# EAGLE design lcd (EAGLE 4.16)
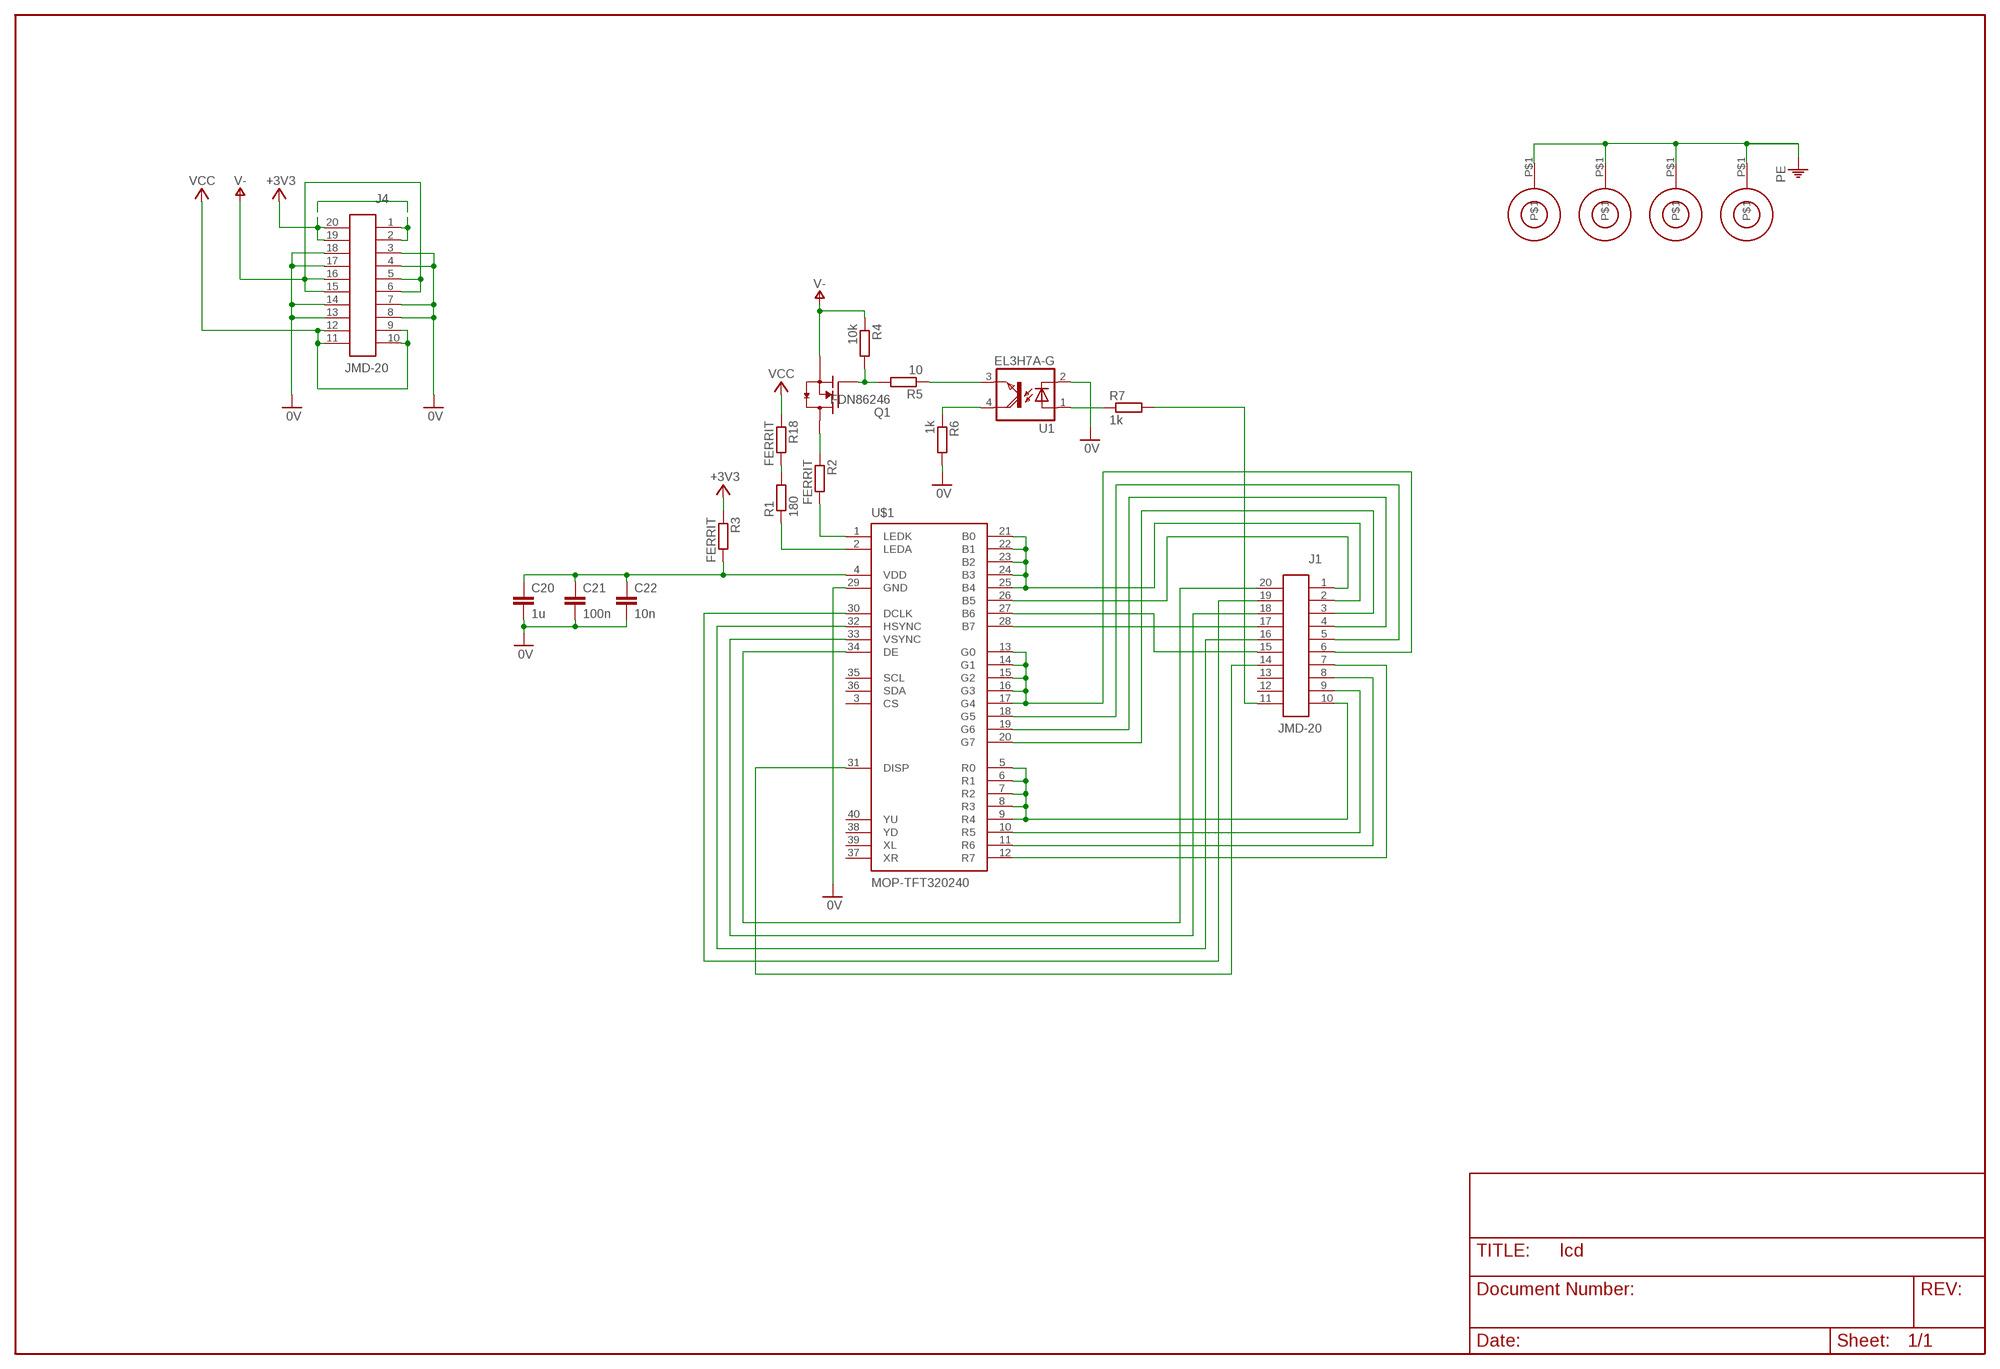
[diagram p0: schematic, sheet 1]

## Parts
C20  1u  C-EUC0603  [C0603]
C21  100n  C-EUC0603  [C0603]
C22  10n  C-EUC0603  [C0603]
J1  JMD-20  [CON]
J4  JMD-20  [CON]
Q1  FDN86246  [SSOT-3]
R1  180  R-EU_R0603  [R0603]
R2  FERRIT  R-EU_R0603  [R0603]
R3  FERRIT  R-EU_R0603  [R0603]
R4  10k  R-EU_R0603  [R0603]
R5  10  R-EU_R0603  [R0603]
R6  1k  R-EU_R0603  [R0603]
R7  1k  R-EU_R0603  [R0603]
R18  FERRIT  R-EU_R0603  [R0603]
U1  EL3H7A-G  [OPTO]
U$1  MOP-TFT320240  [FPC40]
U$3  MOUNT  [MOUNT]
U$4  MOUNT  [MOUNT]
U$7  MOUNT  [MOUNT]
U$11  MOUNT  [MOUNT]

## Nets
0V: C20.2 C21.2 C22.2 J4.3 J4.4 J4.7 J4.8 J4.13 J4.14 J4.17 J4.18 R6.2 U1.2 U$1.29(GND)
+3V3: J4.1 J4.2 J4.19 J4.20 R3.1
N$1: J1.17 U$1.28(B7)
N$4: C20.1 C21.1 C22.1 R3.2 U$1.4(VDD)
N$6: J1.1 U$1.26(B5)
N$7: J1.3 U$1.20(G7)
N$8: J1.4 U$1.19(G6)
N$9: J1.5 U$1.18(G5)
N$10: J1.6 U$1.13(G0) U$1.14(G1) U$1.15(G2) U$1.16(G3) U$1.17(G4)
N$11: J1.7 U$1.12(R7)
N$12: J1.8 U$1.11(R6)
N$13: J1.9 U$1.10(R5)
N$14: J1.10 U$1.5(R0) U$1.6(R1) U$1.7(R2) U$1.8(R3) U$1.9(R4)
N$15: J1.19 U$1.30(DCLK)
N$16: J1.16 U$1.32(HSYNC)
N$17: J1.18 U$1.33(VSYNC)
N$18: J1.20 U$1.34(DE)
N$19: J1.2 U$1.21(B0) U$1.22(B1) U$1.23(B2) U$1.24(B3) U$1.25(B4)
N$21: J1.15 U$1.27(B6)
N$22: R1.1 U$1.2(LEDA)
N$23: R2.2 U$1.1(LEDK)
N$25: R1.2 R18.2
N$26: Q1.D R2.1
N$27: J1.14 U$1.31(DISP)
N$28: R5.1 U1.3
N$29: Q1.G R4.2 R5.2
N$30: R6.1 U1.4
N$31: R7.1 U1.1
N$32: J1.11 R7.2
PE: U$3.P$1 U$4.P$1 U$7.P$1 U$11.P$1
V-: J4.5 J4.6 J4.15 J4.16 Q1.S R4.1
VCC: J4.9 J4.10 J4.11 J4.12 R18.1
Unconnected: J1.12 J1.13 U$1.3(CS) U$1.35(SCL) U$1.36(SDA) U$1.37(XR) U$1.38(YD) U$1.39(XL) U$1.40(YU)

## Library data of the parts
C20-C22 = rcl:C-EU: CAPACITOR, European symbol
J1 J4 = trafo_mod:JMD-20
Q1 = trafo_mod:FDN86246
R1-R7 R18 = rcl:R-EU_: RESISTOR, European symbol
U1 = trafo_mod:EL3H7A-G
U$1 = trafo_mod:MOP-TFT320240
U$3 U$4 U$7 U$11 = trafo_mod:MOUNT

## Board
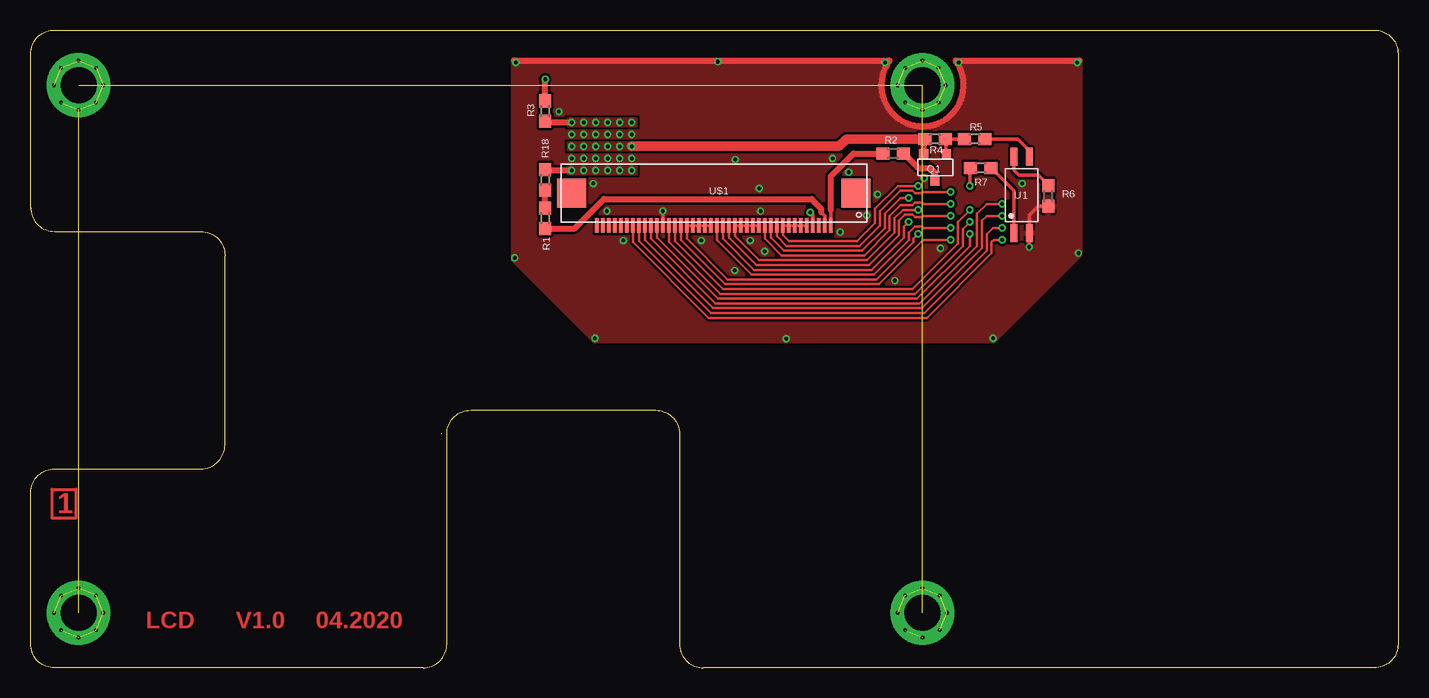
[diagram p1: board, top side]
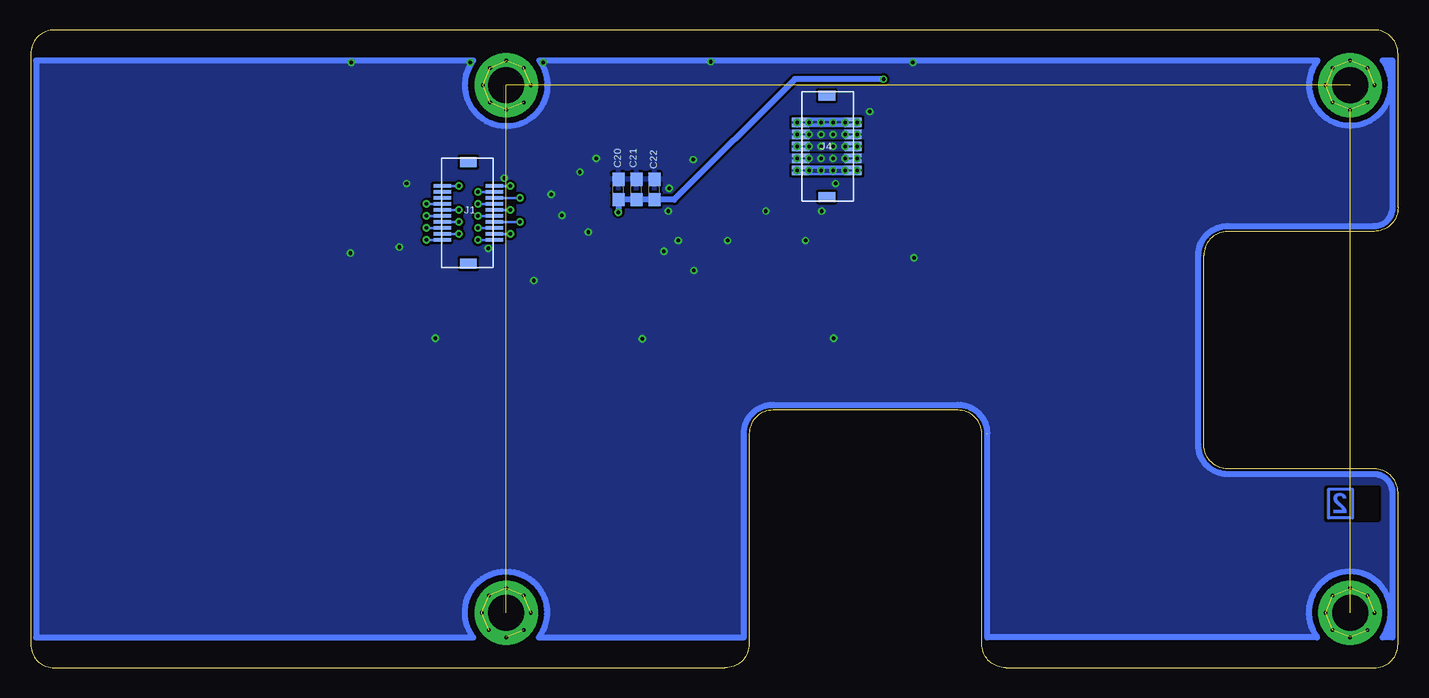
[diagram p2: board, bottom side, seen from below]

Size 114 x 53.2 mm. Coordinates in mm from the lower left corner, seen from the top.
Outline: 43,53.2 112,53.2 arc-90 114,51.2 114,2 arc-90 112,0 56.1,0 arc-90 54.1,2 54.1,19.5 arc90 52.1,21.5 36.7,21.5 arc90 34.7,19.5 34.7,2 arc-90 32.7,0 2,0 arc-90 0,2 0,14.6 arc-90 2,16.6 14.2,16.6 arc90 16.2,18.6 16.2,34.4 arc90 14.2,36.4 2,36.4 arc-90 0,38.4 0,51.2 arc-90 2,53.2 43,53.2
Copper layers (1+2*15+16): Top 0.035mm / dielectric 0.1mm / Route2 0.035mm / dielectric 1.3mm / Route15 0.035mm / dielectric 0.1mm / Bottom 0.035mm
Design rules "default": minimum track width 10mil, minimum drill 0.2mm, track to track 5mil, track to pad 5mil, pad to pad 5mil, via to via 5mil, smd to smd 0mil, copper to edge 12mil, drill to drill 8mil, minimum pad ring 10mil, minimum via ring 4mil, stop-mask expansion 3mil, vias tented up to drill 20mil, thermal gap 0.2mm
tKeepout: area 2.2,9.1 to 5,13.5
bKeepout: area 1.6,12.3 to 6,15
tRestrict: area 2.2,9.1 to 5,13.5; area 71.7,2.1 to 73.1,4.7; area 5.5,2 to 6.7,4.8; area 71.7,48.6 to 73.1,51.4; area 5.7,48.6 to 6.7,51.2; area 1.4,48.6 to 2.3,51.2; area 76,48.6 to 77,51.4; area 75.8,2.1 to 77,4.6; area 1.3,1.4 to 2.6,4.6
bRestrict: area 71.7,2.1 to 73.1,4.7; area 76.1,2.1 to 77,4.6; area 1.6,12.3 to 6,15

### Footprints (pad centres in the part's own frame; a part is rotated, then mirrored left to right if it is on the bottom)
C0603 = smd 1.1 x 1: 1 -0.85,0; 2 0.85,0
CON = smd 0.3 x 1.45: 1 -3,0.5; 2 -2.5,0.5; 3 -2,0.5; 4 -1.5,0.5; 5 -1,0.5; 6 -0.5,0.5; 7 0,0.5; 8 0.5,0.5; 9 1,0.5; 10 1.5,0.5; 11 1.5,4.85; 12 1,4.85; 13 0.5,4.85; 14 0,4.85; 15 -0.5,4.85; 16 -1,4.85; 17 -1.5,4.85; 18 -2,4.85; 19 -2.5,4.85; 20 -3,4.85 | smd 0.85 x 1.4: P$1 -4.975,2.675; P$2 3.475,2.675
SSOT-3 = smd 0.762 x 0.762: D 0,2.286; G -0.953,0; S 0.953,0
R0603 = smd 1.1 x 1: 1 -0.85,0; 2 0.85,0
OPTO = smd 1.5 x 0.6: 1 -2.94,0.47; 2 -2.94,-0.8; 3 3.41,-0.8; 4 3.41,0.47
FPC40 = smd 0.3 x 1.2: 1 -9.3,2.9; 2 -8.8,2.9; 3 -8.3,2.9; 4 -7.8,2.9; 5 -7.3,2.9; 6 -6.8,2.9; 7 -6.3,2.9; 8 -5.8,2.9; 9 -5.3,2.9; 10 -4.8,2.9; 11 -4.3,2.9; 12 -3.8,2.9; 13 -3.3,2.9; 14 -2.8,2.9; 15 -2.3,2.9; 16 -1.8,2.9; 17 -1.3,2.9; 18 -0.8,2.9; 19 -0.3,2.9; 20 0.2,2.9; 21 0.7,2.9; 22 1.2,2.9; 23 1.7,2.9; 24 2.2,2.9; 25 2.7,2.9; 26 3.2,2.9; 27 3.7,2.9; 28 4.2,2.9; 29 4.7,2.9; 30 5.2,2.9; 31 5.7,2.9; 32 6.2,2.9; 33 6.7,2.9; 34 7.2,2.9; 35 7.7,2.9; 36 8.2,2.9; 37 8.7,2.9; 38 9.2,2.9; 39 9.7,2.9; 40 10.2,2.9; P$35 7.7,2.9 | smd 2.4 x 2.4: G1 -11.4,0.2; G2 12.3,0.2
MOUNT = drill 3 pad 5.3 round: P$1 0,0

### Placement (x,y rotation side)
C20  65,39.9 90 bottom
C21  63.5,39.9 90 bottom
C22  62,39.9 90 bottom
J1  74.83,38.7 90 bottom
J4  50.3,42.75 270 bottom
Q1  75.4,42.9 180 top
R1  42.9,37.5 90 top
R2  71.9,42.9 180 top
R3  42.9,46.44 90 top
R4  75.4,44.1 0 top
R5  78.7,44.1 180 top
R6  84.83,39.36 270 top
R7  79.2,41.7 180 top
R18  42.9,40.7 270 top
U1  82.45,39.21 90 top
U$1  57.4,39.8 180 top
U$3  74.35,48.6 0 top
U$4  74.35,4.6 0 top
U$7  4,48.6 0 top
U$11  4,4.6 0 top

### Tracks (layer width: path | path; a pad name or v marks a point on that pad's centre or on a via)
0V  (via drill 0.3 pad 0.6)  (1 unrouted)
  Top 0.3: U$1.29 v52.7,38.1 | R6.2 84,38.5 83.25,37.75 U1.2 83.25,35.15 83.3,35.1 v83.25,35.1
  Top 0.5: 40.3,50.65 71.5,50.65 | 71.5,50.65 71.55,50.65 | 87.45,50.65 77.1,50.65 arc-253 71.6,50.65 71.5,50.65
  Bottom 0.5: 34.25,19.5 arc-90 36.7,21.95 52.1,21.95 arc-90 54.55,19.5 54.55,2.55 71.65,2.55 arc-255 77.1,2.55 113.55,2.55 113.55,50.65 77.1,50.65 arc-253 71.6,50.65 6.7,50.65 arc-254 1.3,50.65 0.45,50.65 0.45,38.45 | 0.45,38.4 arc90 2,36.85 14.2,36.85 arc-90 16.65,34.4 16.65,18.6 arc-90 14.2,16.15 2,16.15 arc90 0.45,14.6 0.45,2.55 1.3,2.55 arc-255 6.75,2.55 34.25,2.55 34.25,19.55
  other vias: 50.1,44.5 45.1,42.5 50.1,42.5 46.1,42.5 49.1,42.5 47.1,42.5 48.1,42.5 46.1,44.5 47.1,44.5 48.1,44.5 49.1,44.5 45.1,44.5 48.05,38.1 60.85,38.1 44.05,46.4 40.35,34.2 47.05,27.5 80.25,27.5 87.35,34.6 87.25,50.5 40.45,50.5 66.85,42.5 60.75,40 46.9,40.4 58.75,42.4 77.35,50.5 71.25,50.5 57.3,50.55 63,27.45 49.4,35.65 72.05,32.3 75.85,35 55.9,35.65 58.7,33.15 69.7,37.75 60,35.65 70.6,39.5 68.2,41.35 74.5,40.85 67.5,36.35 61.2,34.75 82.65,40.4
  pour Bottom (no thermals): 44.3,42.8 50.9,42.8 50.9,42.2 44.3,42.2
  pour Bottom (no thermals): 44.4,44.8 50.9,44.8 50.9,44.2 44.4,44.2
  pour Top (no thermals): 44.8,44.2 50.5,44.2 50.5,44.8 44.8,44.8
  pour Top (no thermals): 44.8,42.2 50.5,42.2 50.5,42.8 44.8,42.8
  pour Bottom (isolate 0.2, rank 2): -1.55,2.5 0.65,2.5 0.45,5.6 1.9,7.6 4.05,8.25 6.1,7.65 7.45,6.2 7.75,4.05 6.75,2.5 71.25,2.5 70.75,5.15 72.15,7.75 75,8.25 77.6,6.75 77.85,4.35 77.4,2.6 78,2.5 118.85,2.5 116.95,50.7 77.05,50.7 77.95,48.85 77.65,46.75 75.9,45.2 73.2,45 71.25,46.35 70.6,48.6 71.4,50.7 7,50.7 7.6,48 6.45,45.9 4,45 1.45,45.9 0.4,47.8 0.85,50.5 0.85,50.7 -4.35,50.7 -3.85,2.5 1.2,2.5
  pour Top (isolate 0.2, rank 2): 40.2,50.7 40.2,34.1 47,27.3 80.3,27.3 87.5,34.5 87.5,50.7 77.6,50.7 77.5,50.5 78,48.9 77.9,47.3 77,45.9 75.4,45.2 73.7,45.1 71.7,46 70.9,47.3 70.6,49 71.1,50.7
+3V3  (via drill 0.3 pad 0.6)
  Top 0.5: R3.1 42.99,45.5 v45.1,45.5
  Bottom 0.254: J4.20 45.4,45.7
  Bottom 0.3: J4.19 J4.2 49.8,45.3 | J4.20 J4.1 49.8,45.7
  other vias: 46.1,45.5 47.1,45.5 48.1,45.5 49.1,45.5 50.1,45.5
  pour Bottom (no thermals): 44.8,45.8 50.5,45.8 50.5,45.2 44.8,45.2
  pour Top (no thermals): 44.8,45.2 50.5,45.2 50.5,45.8 44.8,45.8
N$1  (via drill 0.3 pad 0.6)
  Top 0.2: v78.3,37.2 77.7,36.6 77.7,35.2 73.7,31.2 57.5,31.2 53.2,35.5 U$1.28 53.2,37
  Bottom 0.2: v78.3,37.2 J1.17
N$4  (via drill 0.3 pad 0.6)
  Top 0.3: U$1.4 65.2,37.8 v65,38
  Top 0.5: R3.2 v42.9,49.1
  Bottom 0.5: v65,38 C20.1 64.95,39.05 64.9,39.1 64.85,39.05 C21.1 63.5,39.1 63.45,39.05 C22.1 60.35,39.05 50.3,49.1 v42.9,49.1
N$5
  Bottom 0.3: 0.9,2.7 0.7,2.7 0.7,3.1
N$6  (via drill 0.3 pad 0.6)
  Top 0.2: v76.7,35.7 74.4,35.7 70.7,32 57.9,32 54.2,35.7 U$1.26
  Bottom 0.2: v76.7,35.7 J1.1
N$7  (via drill 0.3 pad 0.6)
  Top 0.2: v76.7,36.7 74.4,36.7 74.3,36.8 73.7,36.8 73.2,36.3 73.2,35.7 70.3,32.8 60.1,32.8 57.2,35.7 U$1.20 57.2,37
  Bottom 0.2: v76.7,36.7 J1.3
N$8  (via drill 0.3 pad 0.6)
  Top 0.2: v73.2,37.2 72.8,36.8 72.8,35.9 70.1,33.2 60.3,33.2 57.7,35.8 U$1.19 57.7,37
  Bottom 0.2: v73.2,37.2 J1.4
N$9  (via drill 0.3 pad 0.6)
  Top 0.2: v76.7,37.7 74.4,37.7 74.3,37.6 73.7,37.6 73.5,37.8 72.9,37.8 72.4,37.3 72.4,36.1 69.9,33.6 60.5,33.6 58.2,35.9 U$1.18
  Bottom 0.2: v76.7,37.7 J1.5
N$10  (via drill 0.3 pad 0.6)
  Top 0.2: v74,38.2 72.7,38.2 72,37.5 72,36.3 69.7,34 60.7,34 58.7,36 U$1.17 U$1.16 U$1.15 U$1.14 U$1.13
  Bottom 0.2: v74,38.2 J1.6
N$11  (via drill 0.3 pad 0.6)
  Top 0.2: v76.7,38.7 74.4,38.7 74.3,38.8 73.7,38.8 73.5,38.6 72.5,38.6 71.6,37.7 71.6,36.5 69.5,34.4 62.6,34.4 61.2,35.8 U$1.12
  Bottom 0.2: 76.6,38.7 J1.7 | v76.7,38.7 76.6,38.7 | 76.6,38.7 75.23,38.7
N$12  (via drill 0.3 pad 0.6)
  Top 0.2: U$1.11 61.7,35.9 62.8,34.8 69.3,34.8 71.2,36.7 71.2,37.9 72.5,39.2 v73.2,39.2
  Bottom 0.2: v73.2,39.2 J1.8
N$13  (via drill 0.3 pad 0.6)
  Top 0.2: v76.7,39.7 74.4,39.7 74.3,39.6 73.7,39.6 73.5,39.8 72.5,39.8 70.8,38.1 70.8,36.9 69.1,35.2 63,35.2 62.2,36 U$1.10
  Bottom 0.2: v76.7,39.7 J1.9
N$14  (via drill 0.3 pad 0.6)
  Top 0.2: v74,40.2 72.3,40.2 70.4,38.3 70.4,37.1 68.9,35.6 63.2,35.6 62.7,36.1 U$1.9 U$1.8 U$1.7 U$1.6 U$1.5
  Bottom 0.2: v74,40.2 J1.10
N$15  (via drill 0.3 pad 0.6)
  Top 0.2: v78.3,36.2 78.3,35.2 73.9,30.8 57.3,30.8 52.2,35.9 U$1.30 52.2,37
  Bottom 0.2: v78.3,36.2 J1.19
N$16  (via drill 0.3 pad 0.6)
  Top 0.2: v81,37.7 79.7,37.7 79.3,37.3 79.3,35 74.3,30 56.9,30 51.2,35.7 U$1.32
  Bottom 0.2: v81,37.7 J1.16
N$17  (via drill 0.3 pad 0.6)
  Top 0.2: v81,36.7 80.2,36.7 79.7,36.2 79.7,34.8 74.5,29.6 56.7,29.6 50.7,35.6 U$1.33
  Bottom 0.2: v81,36.7 J1.18
N$18  (via drill 0.3 pad 0.6)
  Top 0.2: v81,35.7 80.3,35.7 80.1,35.5 80.1,34.6 74.7,29.2 56.5,29.2 50.2,35.5 U$1.34
  Bottom 0.2: v81,35.7 J1.20
N$19  (via drill 0.3 pad 0.6)
  Top 0.2: v74,36.2 73.6,35.8 73.6,35.5 70.5,32.4 58.1,32.4 54.7,35.8 U$1.25 U$1.24 U$1.23 U$1.22 U$1.21
  Bottom 0.2: v74,36.2 J1.2
N$20
  Bottom 0.3: 0.7,50.5 0.8,50.5 0.8,50.1
N$21  (via drill 0.3 pad 0.6)
  Top 0.2: v78.3,38.2 77.3,37.2 77.3,35.4 73.5,31.6 57.7,31.6 53.7,35.6 U$1.27 53.7,37
  Bottom 0.2: v78.3,38.2 J1.15
N$22
  Top 0.3: U$1.2 66.2,37.7 65.9,38
  Top 0.5: 65.9,38 65.9,38.3 65.1,39.1 47.8,39.1 45.7,37 | 45.7,37 45.6,36.9 | R1.1 45.35,36.65 45.7,37
N$23
  Top 0.3: U$1.1 66.7,38.2
  Top 0.5: 66.7,38.2 66.7,41 68.6,42.9 R2.2
N$25
  Top 0.5: R1.2 R18.2
N$26
  Top 0.5: Q1.D 75.4,41.3 75,41.7 74,41.7 72.8,42.9 R2.1
N$27  (via drill 0.3 pad 0.6)
  Top 0.2: v81,38.7 79.7,38.7 78.9,37.9 78.9,35.2 74.1,30.4 57.1,30.4 51.7,35.8 U$1.31
  Bottom 0.2: v81,38.7 J1.14
N$28
  Top 0.3: U1.3 83.25,43.15 82.3,44.1 R5.1 79.5,44.1
N$29
  Top 0.3: 76.4,44.1 R5.2 | Q1.G 76.3,42.95 76.3,44.1
  Top 0.5: R4.2 76.3,44.1 76.4,44.1 76.35,44.05
N$30
  Top 0.3: U1.4 81.98,41.52 82.4,41.1 84,41.1 84.83,40.27 R6.1
N$31
  Top 0.3: R7.1 80.1,41.7 81.98,39.82 U1.1
N$32  (via drill 0.3 pad 0.6)
  Top 0.3: 78.35,41.75 78.4,41.8 | 78.35,41.75 R7.2 | v78.3,40.2 78.3,41.7 78.35,41.75
  Bottom 0.2: v78.3,40.2 J1.11
N$46
  Bottom 0.254: 3.8,12.5 3.8,14.9 5.8,14.9 5.8,12.5 3.8,12.5
N$52
  Top 0.254: 1.8,14.9 3.8,14.9 3.8,12.5 1.8,12.5 1.8,14.9
N$121  (via drill 0.3, 0.3 pad 0.6)  (1 unrouted)
  other vias: 74.35,2.55 72.9,3.15
PE  (via drill 0.3 pad 0.6)  (19 unrouted)
  other vias: 4,6.65 5.45,3.15 2.55,3.15 5.45,6.05 2.55,6.05 6.05,4.6 1.95,4.6 4,2.55 5.45,47.15 5.45,50.05 4,50.65 4,46.55 2.55,50.05 1.95,48.6 2.55,47.15 6.05,48.6
PE1  (via drill 0.3 pad 0.6)  (5 unrouted)
  other vias: 75.8,3.15 76.4,4.6 75.8,6.05 74.35,6.65 72.9,6.05 72.3,4.6
PE2  (via drill 0.3 pad 0.6)  (7 unrouted)
  other vias: 72.9,50.05 75.7,50.05 72.9,47.15 75.7,47.15 76.3,48.6 74.35,46.55 74.35,50.65 72.3,48.6
V-  (via drill 0.3 pad 0.6)
  Top 0.5: Q1.S 74.45,44.05 74.5,44.1
  Top 0.8: v50.1,43.5 67.4,43.5 68,44.1 74.5,44.1 R4.1
  other vias: 45.1,43.5 46.1,43.5 47.1,43.5 48.1,43.5 49.1,43.5
  pour Bottom (no thermals): 44.8,43.8 50.5,43.8 50.5,43.2 44.8,43.2
  pour Top (no thermals): 44.8,43.2 50.5,43.2 50.5,43.8 44.8,43.8
VCC  (via drill 0.3 pad 0.6)
  Top 0.5: R18.1 42.85,41.5 v45.1,41.5
  Bottom 0.2: 49.9,41.7 49.9,41.2 45.2,41.2 | J4.12 45.45,41.5 44.9,41.5
  Bottom 0.3: J4.12 49.9,41.75 49.9,41.7
  other vias: 46.1,41.5 47.1,41.5 48.1,41.5 49.1,41.5 50.1,41.5
  pour Bottom (no thermals): 44.8,41.8 50.5,41.8 50.5,41.2 44.8,41.2
  pour Top (no thermals): 44.8,41.2 50.5,41.2 50.5,41.8 44.8,41.8

### Text on the board
Top: 1 | LCD | V1.0 | 04.2020
Bottom: 2